# Altium project HFAC_Stimulator_4channel.PrjPCB (part 2 of 2)

## Sheet Freedom Board Interface.SchDoc
size A4
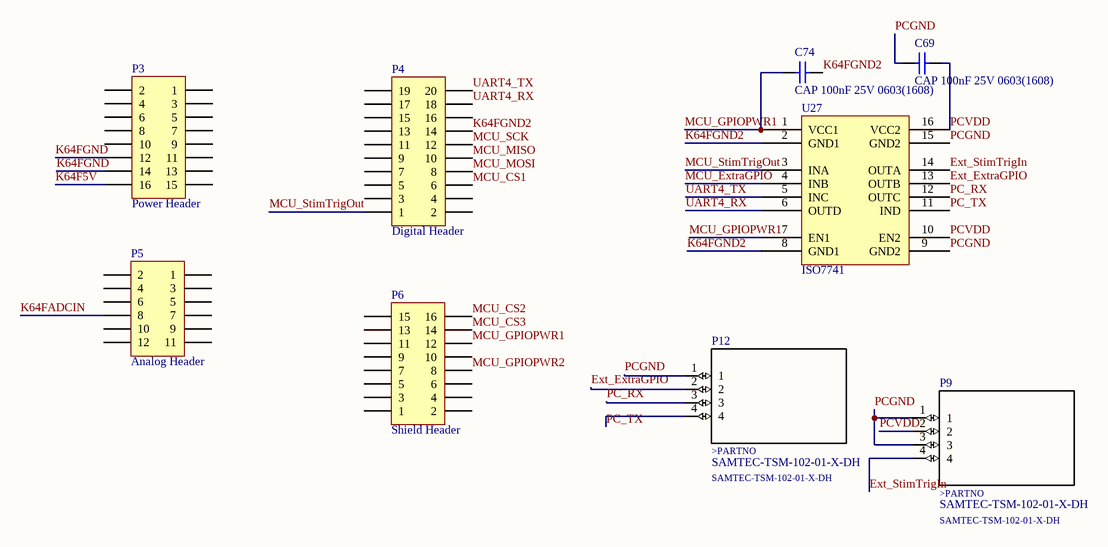
[diagram p6: Freedom Board Interface.SchDoc]

### Parts
C69  CAP 100nF 25V 0603(1608)  [CAPC0603(1608)100_N]
C74  CAP 100nF 25V 0603(1608)  [CAPC0603(1608)100_N]
P3  Power Header  [HDR2X8]
P4  Digital Header  [HDR2X10]
P5  Analog Header  [HDR2X6]
P6  Shield Header  [HDR2X8]
P9  SAMTEC-TSM-102-01-X-DH  [*SAMTEC-TSM-102-01-X-DH]
P12  SAMTEC-TSM-102-01-X-DH  [*SAMTEC-TSM-102-01-X-DH]
U27  ISO7741  [16SSOP JEDEC MO-137 AB]

### Nets
Ext_ExtraGPIO: P12.2 U27.13(OUTB)
Ext_StimTrigIn: P9.4 U27.14(OUTA)
K64F5V: P3.16
K64FADCIN: P5.8
K64FGND: P3.12 P3.14
K64FGND2: C74.1 P4.14 U27.2(GND1) U27.8(GND1)
MCU_CS1: P4.6
MCU_CS2: P6.16
MCU_CS3: P6.14
MCU_ExtraGPIO: U27.4(INB)
MCU_GPIOPWR1: C74.2 P6.12 U27.1(VCC1) U27.7(EN1)
MCU_GPIOPWR2: P6.8
MCU_MISO: P4.10
MCU_MOSI: P4.8
MCU_SCK: P4.12
MCU_StimTrigOut: P4.1 U27.3(INA)
PC_RX: P12.3 U27.12(OUTC)
PC_TX: P12.4 U27.11(IND)
PCGND: C69.2 P9.1 P9.3 P12.1 U27.9(GND2) U27.15(GND2)
PCVDD: C69.1 P9.2 U27.10(EN2) U27.16(VCC2)
UART4_RX: P4.18 U27.6(OUTD)
UART4_TX: P4.20 U27.5(INC)

Not connected (* = marked no-connect by the designer): P3 1 2 3 4 5 6 7 8 9 10 11 13 15; P4 2 3 4 5 7 9 11 13 15 16 17 19; P5 1 2 3 4 5 6 7 9 10 11 12; P6 1 2 3 4 5 6 7 9 10 11 13 15

### Notes on the sheet
- (in symbol SAMTEC-TSM-102-01-X-DH) >PARTNO

### Library data of the parts
C69 C74 = CMP-1035-02589-1: CAP 100nF 25V ±20% 0603 (1608 Metric) Thickness 1mm SMD; Case-EIA: 0603; Tolerance: Â±20%; Case-Metric: 1608; Value: 100nF; Max Thickness: 1 mm; Technology: SMT; Rated Voltage: 25 V
P3 P6 = Header 8X2: Header, 8-Pin, Dual row; LatestRevisionDate: 17-Jul-2002; LatestRevisionNote: Re-released for DXP Platform.; Publisher: Altium Limited
P4 = Header 10X2: Header, 10-Pin, Dual row; LatestRevisionDate: 17-Jul-2002; LatestRevisionNote: Re-released for DXP Platform.; Publisher: Altium Limited
P5 = Header 6X2: Header, 6-Pin, Dual row; LatestRevisionDate: 17-Jul-2002; LatestRevisionNote: Re-released for DXP Platform.; Publisher: Altium Limited
P9 P12 = SAMTEC-TSM-102-01-X-DH: Conn Unshrouded Header HDR 4 POS 2.54mm Solder RA SMD; MF: Samtec Inc.; MP: TSM-102-01-F-DH; SnapEDA_Link: https://www.snapeda.com/parts/TSM-102-01-F-DH/Samtec%20Inc./view-part/?ref=snap; Digi-Key_Part_Number: TSM-102-01-F-DH-ND; Digi-Key_Purchase_URL: https://www.digikey.com/product-detail/en/samtec-inc/TSM-102-01-F-DH/TSM-102-01-F-DH-ND/7623426?utm_source=snapeda&utm_medium=aggregator&utm_campaign=symbol; Package: None; Value: *
U27 = ISO7741: Capacitive Digital Isolator, 3 forward channels, 1 reverse channel, failsafe high, 100 Mbps, 2.25-5.5V

## Sheet Isolated MCU Power Supply.SchDoc
size A4
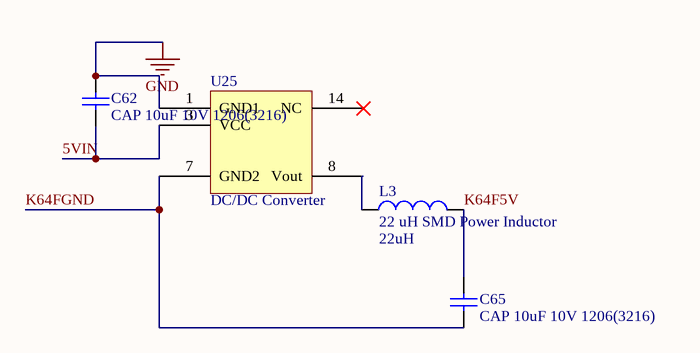
[diagram p7: Isolated MCU Power Supply.SchDoc]

### Parts
C62  CAP 10uF 10V 1206(3216)  [CAPC1206(3216)130_L]
C65  CAP 10uF 10V 1206(3216)  [CAPC1206(3216)130_L]
L3  22 uH SMD Power Inductor  value 22uH  [MURATA PS 8200 Series]
U25  DC/DC Converter  [MURATA PS NXE2]

### Nets
GND: C62.1 U25.1(GND1)
5VIN: C62.2 U25.3(VCC)
K64F5V: C65.1 L3.2
K64FGND: C65.2 U25.7(GND2)
NetL3_1: L3.1 U25.8(Vout)

Not connected (* = marked no-connect by the designer): U25 14(NC)*

### Library data of the parts
C62 C65 = CMP-1037-04970-1: CAP 10uF 10V -20% to +80% 1206 (3216 Metric) Thickness 1.3mm SMD; Case-Metric: 3216; Case-EIA: 1206; Value: 10uF; Rated Voltage: 10 V; Technology: SMT; Max Thickness: 1.3 mm; Tolerance: -20% to +80%
L3 = MURATA PS 82223C: 22 uH SMD Power Inductor, 0.32A RMS, Unshielded, 822 Series, MURATA Power Solutions; Published: 8-Jun-2000; LatestRevisionDate: 23 Nov 2018; LatestRevisionNote: N/A; PackageReference: LPS6235 SERIES; Publisher: Adrien Rapeaux; PackageDescription: 6mm x 6mm x 3.5mm; Code_JEITA: N/A; Code_IEC: N/A
U25 = MURATA PS NXE2: 5V-5V Isolated DC/DC Converter, 2W, 12.7 mm x 10.41 mm x 4.41 mm

## Sheet Low-Voltage Power Supply.SchDoc
size A4
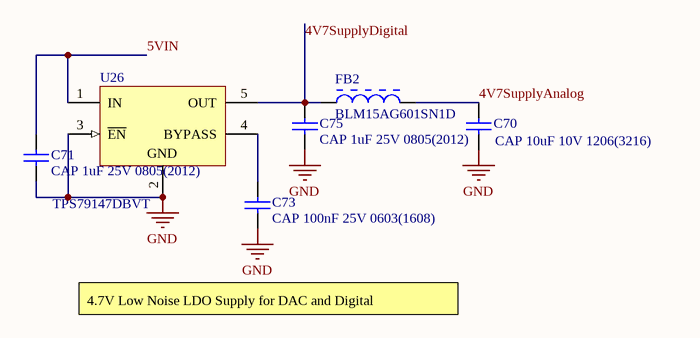
[diagram p8: Low-Voltage Power Supply.SchDoc]

### Parts
C70  CAP 10uF 10V 1206(3216)  [CAPC1206(3216)130_L]
C71  CAP 1uF 25V 0805(2012)  [CAPC0805(2012)145_N]
C73  CAP 100nF 25V 0603(1608)  [CAPC0603(1608)100_N]
C75  CAP 1uF 25V 0805(2012)  [CAPC0805(2012)145_N]
FB2  BLM15AG601SN1D  [MURA-BLM15-CHIP-2_V]
U26  TPS79147DBVT  [TI-DBV5_N]

### Nets
GND: C70.1 C71.1 C73.2 C75.2 U26.2(GND) U26.3(~{EN})
4V7SupplyAnalog: C70.2 FB2.2
4V7SupplyDigital: C75.1 FB2.1 U26.5(OUT)
5VIN: C71.2 U26.1(IN)
NetC73_1: C73.1 U26.4(BYPASS)

### Notes on the sheet
- 4.7V Low Noise LDO Supply for DAC and Digital

### Library data of the parts
C70 = CMP-1037-04970-1: as C62 on sheet Isolated MCU Power Supply; Value: 10uF; Rated Voltage: 10 V; Technology: SMT; Max Thickness: 1.3 mm; Tolerance: -20% to +80%
C71 C75 = CMP-1036-04753-1: CAP 1uF 25V ±10% 0805 (2012 Metric) Thickness 1.45mm SMD; Case-EIA: 0805; Case-Metric: 2012; Tolerance: Â±10%; Max Thickness: 1.45 mm; Value: 1uF; Rated Voltage: 25 V; Technology: SMT
C73 = CMP-1035-02589-1: as C69 on sheet Freedom Board Interface; Value: 100nF; Max Thickness: 1 mm; Technology: SMT; Rated Voltage: 25 V
FB2 = CMP-0686-00187-3: Chip Ferrite Bead for General Use, 600 Ohm, 300 mA, -55 to 125 degC, 1 x 0.5 x 0.55 mm SMD, Tape and Reel; Manufacturer: Murata; Impedance (at 100 MHz): 600 Ohm +/- 25%; DC Resistance: 0.52 Ohm Max.; Rated Current: 300 mA; PackageDescription: 2-Pin Chip, Body 1 x 0.5 mm; Mounting Technology: Surface Mount; ComponentLink1Description: Manufacturer URL; ComponentLink3Description: Package Specification; ComponentLink2Description: Datasheet; Operating Temperature Range: -55 to 125 degC; Packing: Tape and Reel; ComponentLink1URL: http://www.murata.com/; PackageReference: BLM15-2; DatasheetVersion: 08/2013; PartNumber: BLM15AG601SN1D; ComponentLink3URL: http://www.murata.com/products/catalog/pdf/c31e.pdf; ComponentLink2URL: http://www.murata.com/products/catalog/pdf/c31e.pdf
U26 = CMP-0394-00191-1: Single Output High PSRR LDO, 100 mA, Fixed 4.7 V Output, 2.7 to 5.5 V Input, 5-pin SOT-23 (DBV), -40 to 125 degC, Green (RoHS & no Sb/Br); Manufacturer: Texas Instruments; Accuracy(%): 2; Iout(Max)(A): 0.1; Vin(Max)(V): 5.5; Vin(Min)(V): 2.7; Iq(Typ)(mA): 0.2; Vout Adj(Max)(V): 4.7; SubFamily: Single Channel LDO; Vdo(Typ)(mV): 38; ComponentLink1URL: http://www.ti.com/; ComponentLink3URL: http://www.ti.com/litv/pdf/mpds018i; PackageVersion: 4073253-4/K; PartNumber: TPS79147DBVT; ComponentLink2Description: Datasheet; PackageReference: DBV5; Code_JEDEC: MO-178; PackageDescription: 5-Pin Plastic Small Outline, Body 1.60 Ãƒâ€” 2.90 mm, Pitch 0.95 mm; Vout Adj(Min)(V): 4.7; DatasheetVersion: SLVS325C; ComponentLink2URL: http://www.ti.com/general/docs/lit/getliterature.tsp?genericPartNumber=TPS79147&fileType=pdf; ComponentLink3Description: Package Specification; Eco-Plan: Green (RoHS & no Sb/Br); ComponentLink1Description: Manufacturer URL; Mounting Technology: Surface Mount; Fixed Output Options(V): 4.7

## Sheet Electrode Monitor Channel.SchDoc
size A4
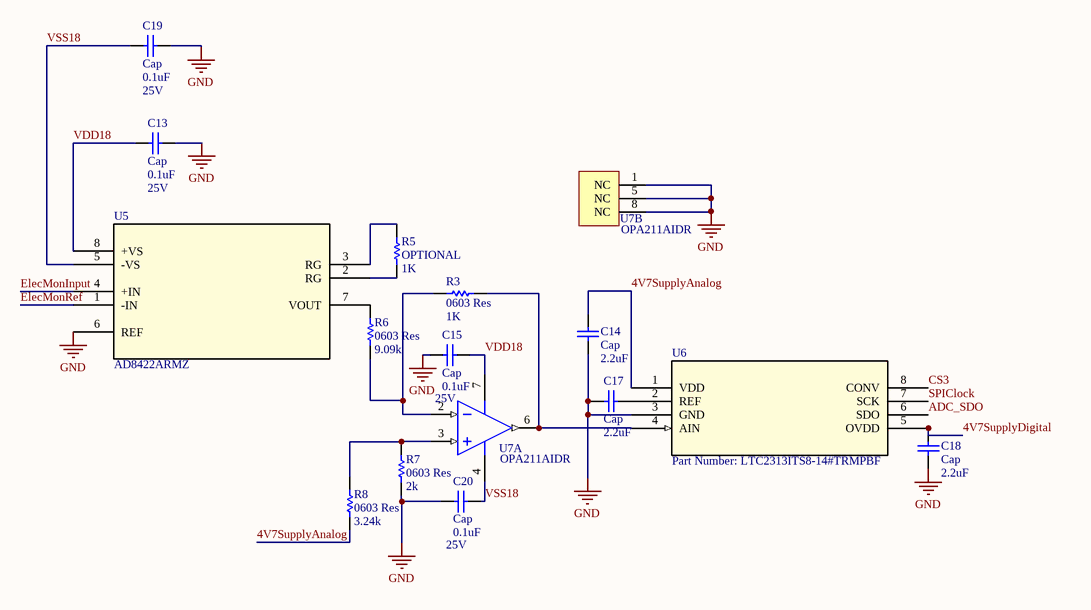
[diagram p9: Electrode Monitor Channel.SchDoc]

### Parts
C13  Cap  value 0.1uF  Rated Voltage: 25V  [1608[0603]]
C14  Cap  value 2.2uF  [1608[0603]]
C15  Cap  value 0.1uF  Rated Voltage: 25V  [1608[0603]]
C17  Cap  value 2.2uF  [1608[0603]]
C18  Cap  value 2.2uF  [1608[0603]]
C19  Cap  value 0.1uF  Rated Voltage: 25V  [1608[0603]]
C20  Cap  value 0.1uF  Rated Voltage: 25V  [1608[0603]]
R3  0603 Res  value 1K  [J1-0603]
R5  OPTIONAL  value 1K  [J1-0603]
R6  0603 Res  value 9.09k  [J1-0603]
R7  0603 Res  value 2k  [J1-0603]
R8  0603 Res  value 3.24k  [J1-0603]
U5  AD8422ARMZ  [MSOP-8]
U6  Part Number: LTC2313ITS8-14#TRMPBF  [TSOT-23_TS8]
U7  OPA211AIDR  [TI-D8_L]  (parts A,B of 2)

### Nets
GND: C13.1 C14.1 C15.1 C17.1 C18.1 C19.1 C20.1 R7.2 U5.6(REF) U6.3(GND) U7.1(NC) U7.5(NC) U7.8(NC)
4V7SupplyAnalog: C14.2 R8.2 U6.1(VDD)
4V7SupplyDigital: C18.2 U6.5(OVDD)
ADC_SDO: U6.6(SDO)
CS3: U6.8(CONV)
ElecMonInput: U5.4(+IN)
ElecMonRef: U5.1(-IN)
SPIClock: U6.7(SCK)
VDD18: C13.2 C15.2 U5.8(+VS) U7.7(V+)
VSS18: C19.2 C20.2 U5.5(-VS) U7.4(V-)
NetC17_2: C17.2 U6.2(REF)
NetR3_1: R3.1 U6.4(AIN) U7.6(OUT)
NetR3_2: R3.2 R6.1 U7.2(IN-)
NetR5_1: R5.1 U5.2(RG)
NetR5_2: R5.2 U5.3(RG)
NetR6_2: R6.2 U5.7(VOUT)
NetR7_1: R7.1 R8.1 U7.3(IN+)

### Library data of the parts
C13-C15 C17-C20 = Cap: Capacitor; Published: 8-Jun-2000; LatestRevisionDate: 17-Jul-2002; LatestRevisionNote: Re-released for DXP Platform.; PackageReference: RAD-0.3; Publisher: Altium Limited; PackageDescription: Radial Cap, Thru-Hole; 2 Leads; 0.3 in Pin Spacing
R3 R5-R8 = Res1: Resistor, gain-setting (OPTIONAL), 0603; Published: 8-Jun-2000; LatestRevisionDate: 17-Jul-2002; LatestRevisionNote: Re-released for DXP Platform.; PackageReference: AXIAL-0.3; Publisher: Altium Limited; PackageDescription: Axial Device, Thru-Hole; 2 Leads; 0.3 in Pin Spacing
U5 = AD8422ARMZ: IC OPAMP INSTR 2.2MHZ RRO 8MSOP; Vendor: Analog Devices Inc; Built_By: EMA_UL_Team; Manufacturer_Part_Number: AD8422ARMZ; Copyright: Copyright (C) 2018 Accelerated Designs. All rights reserved; RefDes: RefDes; Type: DEV; Value: Value
U6 = LTC2313ITS8-14#T: 14-bit 2.5MSPS Single-Ended ADC, 3-5V single supply on TSOT-8; Vendor: Linear Technology; Built_By: EMA_UL_Team; Manufacturer_Part_Number: LTC2313ITS8-14#TRMPBF; Copyright: Copyright (C) 2018 Accelerated Designs. All rights reserved; RefDes: RefDes; Type: DEV; Value: Value
U7 = CMP-0272-00537-2: 1.1 nV/rtHz Noise, Low Power, Precision Operational Amplifier, 4.5 to 36 V, -40 to 125 degC, 8-pin SOIC (D8), Green (RoHS & no Sb/Br); Manufacturer: Texas Instruments; Total Supply Voltage(Min)(+5V is 5, +/-5V is 10): 4.5; Number of Channels: 1; Offset Drift(Typ)(uV/C): 0.15; GBW(Typ)(MHz): 45; Slew Rate(Typ)(V/us): 27; Sub Family: High Supply Voltage Amplifier (>=30V), Low Noise Amp (<=10nV/rtHz), Low Offset Voltage Amplifier (<=500uV), Precision Amplifier; Rating: Catalog; IIB(Max)(pA): 175000; Vio (25C)(Max)(mV): 0.125; Packing: LARGE T&R; Total Supply Voltage(Max)(+5V is 5, +/-5V is 10): 36; CMRR(Min)(dB): 114; Eco-Plan: Green (RoHS & no Sb/Br); DatasheetVersion: SBOS377G; Iq per channel(Max)(mA): 4.5; ComponentLink2URL: http://www.ti.com/lit/ds/symlink/opa211.pdf; ComponentLink1Description: Manufacturer URL; ComponentLink3Description: Package Specification; Code_JEDEC: MS-012; ComponentLink3URL: http://www.ti.com/litv/pdf/msoi002j; PartNumber: OPA211AIDR; ComponentLink2Description: Datasheet; PackageReference: D8; PackageVersion: 4040047-3/M, 06/2011; ComponentLink1URL: http://www.ti.com/; Mounting Technology: Surface Mount; PackageDescription: 8-Pin Plastic Small Outline, Body 4.9 x 3.9 mm, Pitch 1.27 mm; PartId: 1

## Sheet N17V5 Reference.SchDoc
size A4
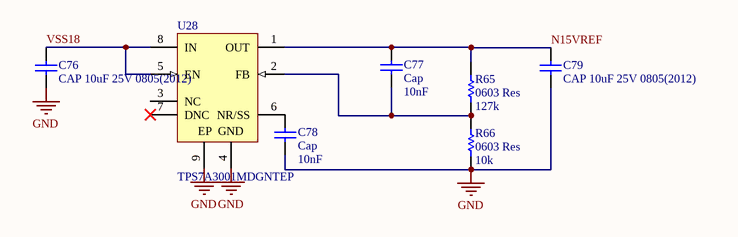
[diagram p10: N17V5 Reference.SchDoc]

### Parts
C76  CAP 10uF 25V 0805(2012)  [CAPC0805(2012)145_N]
C77  Cap  value 10nF  [1608[0603]]
C78  Cap  value 10nF  [1608[0603]]
C79  CAP 10uF 25V 0805(2012)  [CAPC0805(2012)145_N]
R65  0603 Res  value 127k  [J1-0603]
R66  0603 Res  value 10k  [J1-0603]
U28  TPS7A3001MDGNTEP  [DGN0008D_M]

### Nets
GND: C76.1 C78.1 C79.1 R66.2 U28.4(GND) U28.9(EP)
N15VREF: C77.2 C79.2 R65.1 U28.1(OUT)
VSS18: C76.2 U28.5(EN) U28.8(IN)
NetC77_1: C77.1 R65.2 R66.1 U28.2(FB)
NetC78_2: C78.2 U28.6(NR/SS)

Not connected (* = marked no-connect by the designer): U28 3(NC) 7(DNC)*

### Library data of the parts
C76 C79 = CMP-1036-04932-1: CAP 10uF 25V ±10% 0805 (2012 Metric) Thickness 1.45mm SMD; Case-EIA: 0805; Case-Metric: 2012; Tolerance: Â±10%; Technology: SMT; Value: 10uF; Rated Voltage: 25 V; Max Thickness: 1.45 mm
C77 C78 = Cap: Capacitor; Published: 8-Jun-2000; LatestRevisionDate: 17-Jul-2002; LatestRevisionNote: Re-released for DXP Platform.; PackageReference: RAD-0.3; Publisher: Altium Limited; PackageDescription: Radial Cap, Thru-Hole; 2 Leads; 0.3 in Pin Spacing
R65 R66 = Res1: Chip Resistor, 0603, 1%; Published: 8-Jun-2000; LatestRevisionDate: 17-Jul-2002; LatestRevisionNote: Re-released for DXP Platform.; PackageReference: AXIAL-0.3; Publisher: Altium Limited; PackageDescription: Axial Device, Thru-Hole; 2 Leads; 0.3 in Pin Spacing
U28 = CMP-0394-01251-2: Single Output High PSRR LDO, 200 mA, Adjustable -1.18 to -33 V Output, -3 to -36 V Input, with Ultra-Low Noise, 8-pin MSOP (DGN), -55 to 125 degC, Green (RoHS & no Sb/Br); Manufacturer: Texas Instruments; Vdo(Typ)(mV): 216; Iq(Typ)(mA): 0.05; Accuracy(%): 1.5; SubFamily: Single Channel LDO; Iout(Max)(A): 0.2; Vin(Min)(V): -3; PackageDescription: 8-pin Plastic Small Outline, Body 3 x 3 mm, Pitch 0.65 mm; ComponentLink3URL: http://www.ti.com/litv/pdf/mpds046e; ComponentLink1URL: http://www.ti.com/; ComponentLink2Description: Datasheet; ComponentLink2URL: http://www.ti.com/general/docs/lit/getliterature.tsp?genericPartNumber=TPS7A3001-EP&fileType=pdf; Code_JEDEC: MO-187; ComponentLink1Description: Manufacturer URL; Vout Adj(Max)(V): -33; Eco-Plan: Green (RoHS & no Sb/Br); DatasheetVersion: SBVS174; ComponentLink3Description: Package Specification; Vin(Max)(V): -36; PartNumber: TPS7A3001MDGNTEP; PackageReference: DGN0008D; Vout Adj(Min)(V): -1.18; PackageVersion: 4073271/F; Mounting Technology: Surface Mount

## Nets that join several sheets
GND: Power Supply (23 pins), Digital Interfaces (20 pins), Howland Channel 1 (16 pins), Howland Channel 2 (16 pins), Howland Channel 3 (16 pins), Howland Channel 4 (16 pins), Isolated MCU Power Supply (C62.1 U25.1), Low-Voltage Power Supply (6 pins), Electrode Monitor Channel (13 pins), N17V5 Reference (6 pins)
4V7SupplyAnalog: Digital Interfaces (C3.1 C5.2 U2.2 U2.20), Low-Voltage Power Supply (C70.2 FB2.2), Electrode Monitor Channel (C14.2 R8.2 U6.1)
4V7SupplyDigital: Digital Interfaces (6 pins), Low-Voltage Power Supply (C75.1 FB2.1 U26.5), Electrode Monitor Channel (C18.2 U6.5)
5VIN: Power Supply (8 pins), Digital Interfaces (6 pins), Isolated MCU Power Supply (C62.2 U25.3), Low-Voltage Power Supply (C71.2 U26.1)
ADC_SDO: Digital Interfaces (U3.10), Electrode Monitor Channel (U6.6)
CS3: Digital Interfaces (U3.11), Electrode Monitor Channel (U6.8)
Current_Ch1_OUT: Digital Interfaces (U1.2 U1.4), Howland Channel 1 (R19.1 U11.3)
Current_Ch2_OUT: Digital Interfaces (U1.6 U1.8), Howland Channel 2 (R30.1 U15.3)
Current_Ch3_OUT: Digital Interfaces (U1.11 U1.13), Howland Channel 3 (R41.1 U19.3)
Current_Ch4_OUT: Digital Interfaces (U1.15 U1.17), Howland Channel 4 (R52.1 U23.3)
DAC_Ch1_OUT: Digital Interfaces (U2.6), Howland Channel 1 (R10.2)
DAC_Ch2_OUT: Digital Interfaces (U2.4), Howland Channel 2 (R21.2)
DAC_Ch3_OUT: Digital Interfaces (U2.18), Howland Channel 3 (R32.2)
DAC_Ch4_OUT: Digital Interfaces (U2.16), Howland Channel 4 (R43.2)
ElecMonInput: Digital Interfaces (5 pins), Electrode Monitor Channel (U5.4)
ElecMonRef: Digital Interfaces (U4.14 U4.16), Electrode Monitor Channel (U5.1)
K64F5V: Freedom Board Interface (P3.16), Isolated MCU Power Supply (C65.1 L3.2)
K64FGND: Freedom Board Interface (P3.12 P3.14), Isolated MCU Power Supply (C65.2 U25.7)
K64FGND2: Digital Interfaces (C7.2 U3.8), Freedom Board Interface (C74.1 P4.14 U27.2 U27.8)
MCU_CS1: Digital Interfaces (U3.3), Freedom Board Interface (P4.6)
MCU_CS2: Digital Interfaces (U3.5), Freedom Board Interface (P6.16)
MCU_CS3: Digital Interfaces (U3.6), Freedom Board Interface (P6.14)
MCU_GPIOPWR2: Digital Interfaces (C7.1 U3.1), Freedom Board Interface (P6.8)
MCU_MISO: Digital Interfaces (U3.7), Freedom Board Interface (P4.10)
MCU_MOSI: Digital Interfaces (U3.4), Freedom Board Interface (P4.8)
MCU_SCK: Digital Interfaces (U3.2), Freedom Board Interface (P4.12)
N15VREF: Howland Channel 1 (R12.2), Howland Channel 2 (R23.2), Howland Channel 3 (R34.2), Howland Channel 4 (R45.2), N17V5 Reference (C77.2 C79.2 R65.1 U28.1)
SPIClock: Digital Interfaces (U1.22 U2.9 U3.15 U4.22), Electrode Monitor Channel (U6.7)
VDD18: Power Supply (C59.1 FB1.2 R54.2), Digital Interfaces (C1.2 C10.2 U1.1 U4.1), Howland Channel 1 (5 pins), Howland Channel 2 (5 pins), Howland Channel 3 (5 pins), Howland Channel 4 (5 pins), Electrode Monitor Channel (C13.2 C15.2 U5.8 U7.7)
VSS18: Power Supply (C72.2 FB3.1 R56.2), Digital Interfaces (6 pins), Howland Channel 1 (5 pins), Howland Channel 2 (5 pins), Howland Channel 3 (5 pins), Howland Channel 4 (5 pins), Electrode Monitor Channel (C19.2 C20.2 U5.5 U7.4), N17V5 Reference (C76.2 U28.5 U28.8)